# Altium schematic sheet Proyecto_Multicapa_Schematic.SchDoc
size Letter; SheetNumber: 1; SheetTotal: 2
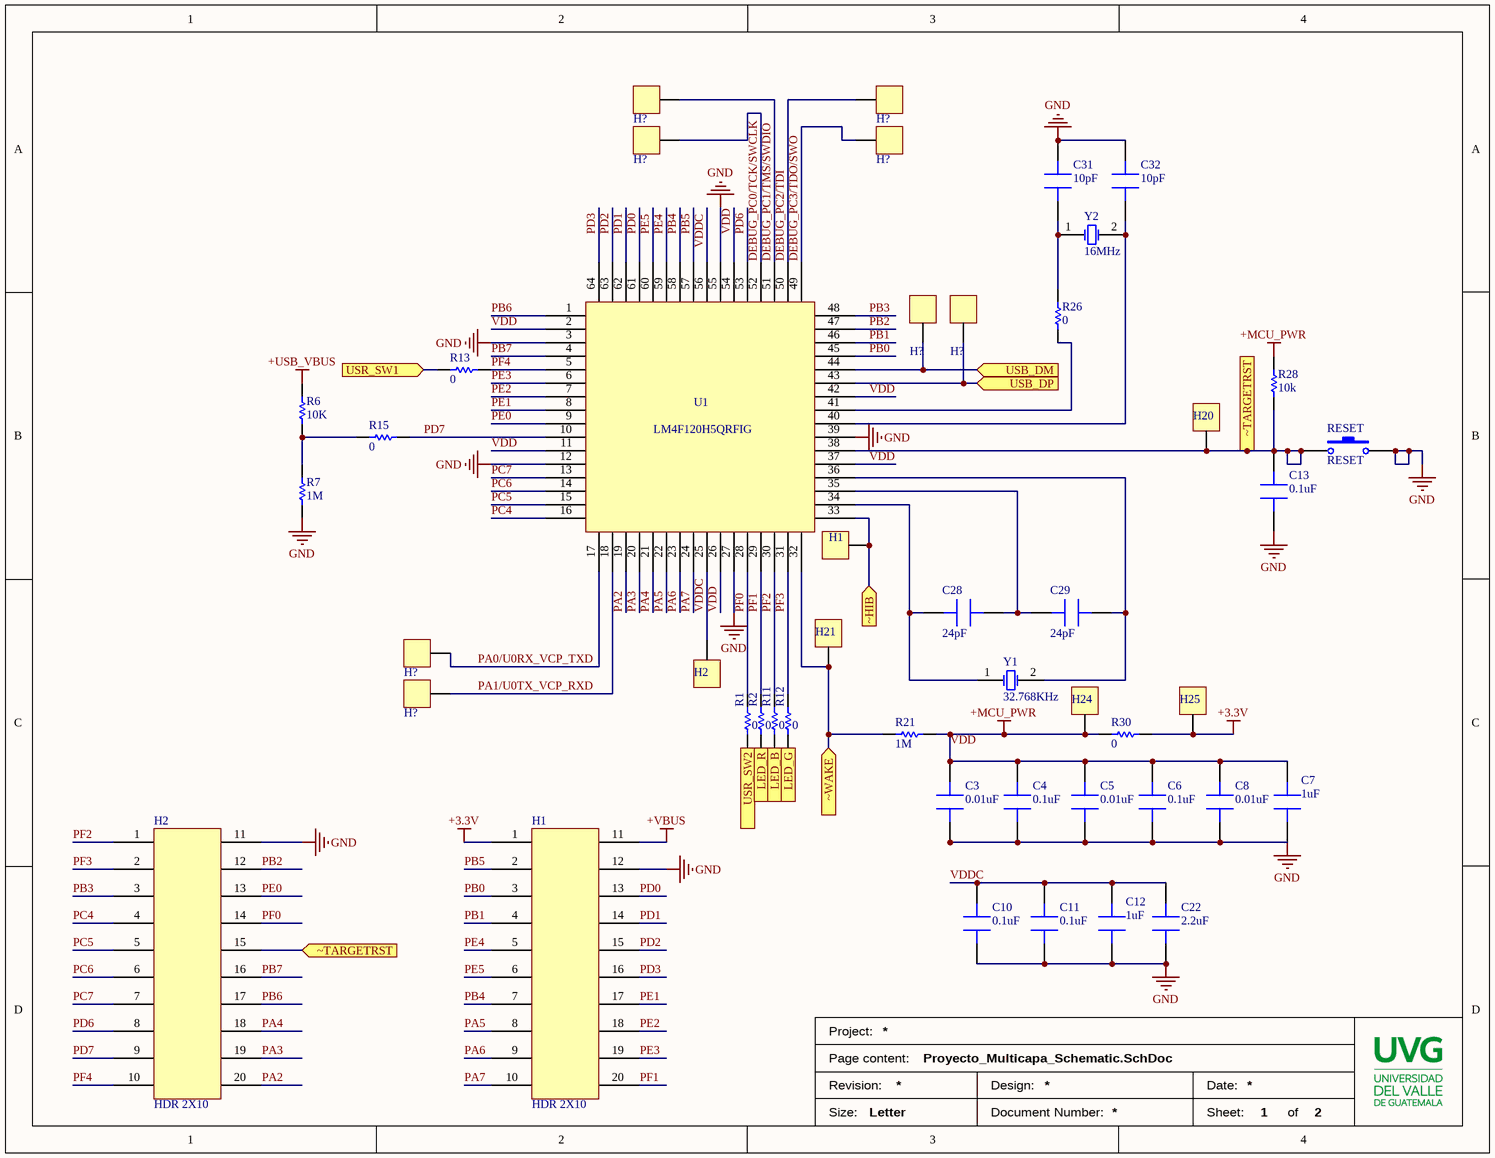
[diagram p0: Proyecto_Multicapa_Schematic.SchDoc]

## Parts
(Parts that share a designator on the sheet are numbered #1, #2 ... from top to bottom, then left to right.)
C3  0.01uF  [C0402]
C4  0.1uF  [C0402]
C5  0.01uF  [C0402]
C6  0.1uF  [C0402]
C7  1uF  [C0402]
C8  0.01uF  [C0402]
C10  0.1uF  [C0402]
C11  0.1uF  [C0402]
C12  1uF  [C0402]
C13  0.1uF  [C0402]
C22  2.2uF  [C0603]
C28  24pF  [C0402]
C29  24pF  [C0402]
C31  10pF  [C0402]
C32  10pF  [C0402]
H1#1  HDR1  [HDR 1X1]  (value not drawn)
H1#2  HDR 2X10  [HDR 2X10]
H2#1  HDR1  [HDR 1X1]  (value not drawn)
H2#2  HDR 2X10  [HDR 2X10]
H20  HDR1  [HDR 1X1]  (value not drawn)
H21  HDR1  [HDR 1X1]  (value not drawn)
H24  HDR1  [HDR 1X1]  (value not drawn)
H25  HDR1  [HDR 1X1]  (value not drawn)
H?#1  HDR1  [HDR 1X1]  (value not drawn)
H?#2  HDR1  [HDR 1X1]  (value not drawn)
H?#3  HDR1  [HDR 1X1]  (value not drawn)
H?#4  HDR1  [HDR 1X1]  (value not drawn)
H?#5  HDR1  [HDR 1X1]  (value not drawn)
H?#6  HDR1  [HDR 1X1]  (value not drawn)
H?#7  HDR1  [HDR 1X1]  (value not drawn)
H?#8  HDR1  [HDR 1X1]  (value not drawn)
R1  0  [Resis 1M]
R2  0  [Resis 1M]
R6  10K  [Resis 1M]
R7  1M  [Resis 1M]
R11  0  [Resis 1M]
R12  0  [Resis 1M]
R13  0  [Resis 1M]
R15  0  [Resis 1M]
R21  1M  [Resis 1M]
R26  0  [Resis 1M]
R28  10k  [Resis 1M]
R30  0  [Resis 1M]
RESET  RESET  [SPST-2]
U1  LM4F120H5QRFIG  [LM4F120H5QRFIG]  (value not drawn)
Y1  32.768KHz  [Crystal 32kHz]
Y2  16MHz  [Crystal 16Mhz]

## Ports
LED_B (in), LED_G (in), LED_R (in), USB_DM (in), USB_DP (in), USR_SW1 (in), USR_SW2 (in), ~HIB (in), ~TARGETRST (in), ~WAKE (in)

## Nets
+3.3V: H1#2.1 H25.1 R30.2
+USB_VBUS: R6.2
+VBUS: H1#2.11
GND: C3.0 C4.0 C5.0 C6.0 C7.0 C8.0 C10.0 C11.0 C12.0 C13.0 C22.0 C31.1 C32.1 H1#2.12 H2#2.11 R7.1 RESET.2 U1.3 U1.12 U1.27 U1.39 U1.55
VDD: C3.1 C4.1 C5.1 C6.1 C7.1 C8.1 H24.1 R21.2 R28.2 R30.1 U1.2 U1.11 U1.26 U1.37 U1.42 U1.54  [also labelled +MCU_PWR]
DEBUG_PC0/TCK/SWCLK: H?#3.1 U1.52
DEBUG_PC1/TMS/SWDIO: H?#1.1 U1.51
DEBUG_PC2/TDI: H?#2.1 U1.50
DEBUG_PC3/TDO/SWO: H?#4.1 U1.49
LED_B: R11.1 ; port LED_B
LED_G: R12.1 ; port LED_G
LED_R: R2.1 ; port LED_R
PA0/U0RX_VCP_TXD: H?#7.1 U1.17
PA1/U0TX_VCP_RXD: H?#8.1 U1.18
PA2: H2#2.20 U1.19
PA3: H2#2.19 U1.20
PA4: H2#2.18 U1.21
PA5: H1#2.8 U1.22
PA6: H1#2.9 U1.23
PA7: H1#2.10 U1.24
PB0: H1#2.3 U1.45
PB1: H1#2.4 U1.46
PB2: H2#2.12 U1.47
PB3: H2#2.3 U1.48
PB4: H1#2.7 U1.58
PB5: H1#2.2 U1.57
PB6: H2#2.17 U1.1
PB7: H2#2.16 U1.4
PC4: H2#2.4 U1.16
PC5: H2#2.5 U1.15
PC6: H2#2.6 U1.14
PC7: H2#2.7 U1.13
PD0: H1#2.13 U1.61
PD1: H1#2.14 U1.62
PD2: H1#2.15 U1.63
PD3: H1#2.16 U1.64
PD6: H2#2.8 U1.53
PD7: H2#2.9 R15.2 U1.10
PE0: H2#2.13 U1.9
PE1: H1#2.17 U1.8
PE2: H1#2.18 U1.7
PE3: H1#2.19 U1.6
PE4: H1#2.5 U1.59
PE5: H1#2.6 U1.60
PF0: H2#2.14 R1.2 U1.28
PF1: H1#2.20 R2.2 U1.29
PF2: H2#2.1 R11.2 U1.30
PF3: H2#2.2 R12.2 U1.31
PF4: H2#2.10 R13.1 U1.5
USB_DM: H?#5.1 U1.44 ; port USB_DM
USB_DP: H?#6.1 U1.43 ; port USB_DP
USR_SW1: R13.2 ; port USR_SW1
USR_SW2: R1.1 ; port USR_SW2
VDDC: C10.1 C11.1 C12.1 C22.1 H2#1.1 U1.25 U1.56
~HIB: H1#1.1 U1.33 ; port ~HIB
~TARGETRST: C13.1 H2#2.15 H20.1 R28.1 RESET.1 U1.38 ; port ~TARGETRST
~WAKE: H21.1 R21.1 U1.32 ; port ~WAKE
NetC28_0: C28.0 U1.34 Y1.1(OSC1)
NetC28_1: C28.1 C29.0 U1.35
NetC29_1: C29.1 U1.36 Y1.2(OSC2)
NetC31_0: C31.0 R26.2 Y2.1(OSC1)
NetC32_0: C32.0 U1.40 Y2.2(OSC2)
NetR6_1: R6.1 R7.2 R15.1
NetR26_1: R26.1 U1.41

## Notes on the sheet
- Project:
- Page content:
- Revision:
- Size:
- Letter
- Design:
- Document Number:
- Date:
- Sheet:
- of

## Library data of the parts
C3 C5 C8 = TMK105B7103KV-F: 0402 0.01 uF 25 V ±10% X7R Automotive Multilayer Ceramic Capacitor; Manufacturer: Taiyo Yuden; Capacitance: 10nF; Voltage Rating: 25V; Supplier 1: Newark; Manufacturer Part Number: TMK105B7103KV-F; Stock 1: 2; Pricing 1: 1 = 0.00200, 25 = 0.00200, 100 = 0.00200, 250 = 0.00200, 500 = 0.00200, 1000 = 0.00200, 2500 = 0.00200, 5000 = 0.00200 (USD); RoHS: Yes; Mount: Surface Mount; Case/Package: 0402; Case Code (Metric): 1005; Case Code (Imperial): 0402; Contact Plating: Tin; Min Operating Temperature: -55°C; Max Operating Temperature: 125°C; Tolerance: 10%; Package Quantity: 1; Packaging: Tape and Reel; Voltage Rating (DC): 25V; Dielectric: X7R; Termination: SMD/SMT; Resistor Type: Ceramic; Series: M; Construction: Flat; Voltage: 25V; Length: 1mm; Width: 0.02inch; Height: 0.5mm; Thickness: 0.022inch; Depth: 0.5mm; REACH SVHC: Unknown; Halogen Free: Halogen Free; RoHS Compliant: Yes; ComponentLink1URL: https://datasheet.ciiva.com/129/tmk105b7103kv-f-ss-129699.pdf?src-supplier=Digi-Key; ComponentLink1Description: https://datasheet.ciiva.com/129/tmk105b7103kv-f-ss-129699.pdf?src-supplier=Digi-Key; ComponentLink2URL: https://datasheet.ciiva.com/30192/438tmk105b7103kv-f-30192315.pdf?src-supplier=Onlinecomponents.com; ComponentLink2Description: https://datasheet.ciiva.com/30192/438tmk105b7103kv-f-30192315.pdf?src-supplier=Onlinecomponents.com; ComponentLink3URL: https://datasheet.ciiva.com/15922/204tmk105b7103kv-f-15922348.pdf?src-supplier=Onlinecomponents.com; ComponentLink3Description: https://datasheet.ciiva.com/15922/204tmk105b7103kv-f-15922348.pdf?src-supplier=Onlinecomponents.com; ComponentLink4URL: https://datasheet.ciiva.com/30156/190tmk105b7103kv-f-30156174.pdf?src-supplier=Onlinecomponents.com; ComponentLink4Description: https://datasheet.ciiva.com/30156/190tmk105b7103kv-f-30156174.pdf?src-supplier=Onlinecomponents.com; ComponentLink5URL: https://datasheet.ciiva.com/28645/746258-28645254.pdf?src-supplier=Element14; ComponentLink5Description: https://datasheet.ciiva.com/28645/746258-28645254.pdf?src-supplier=Element14; ComponentLink6URL: https://datasheet.ciiva.com/7975/746258-7975835.pdf?src-supplier=Element14; ComponentLink6Description: https://datasheet.ciiva.com/7975/746258-7975835.pdf?src-supplier=Element14; Supplier Part Number 1: 77M8496
C4 C6 C10 C11 C13 = EMK105B7104KV-F: 0402 0.1 uF 16 V ±10% Tolerance X7R Multilayer Ceramic Chip Capacitor; Manufacturer: Taiyo Yuden; Capacitance: 100nF; Voltage Rating (DC): 16V; Supplier 1: RSComponents; Manufacturer Part Number: EMK105B7104KV-F; Stock 1: 30000; Pricing 1: 10000 = 0.00300 (GBP); RoHS: Yes; Mount: Surface Mount; Case/Package: 0402; Number of Pins: 2; Case Code (Metric): 1005; Case Code (Imperial): 0402; Min Operating Temperature: -55°C; Max Operating Temperature: 125°C; Tolerance: 10%; Packaging: Tape and Reel; Dielectric: X7R; Package Quantity: 1; Voltage Rating: 16V; Termination: SMD/SMT; Series: M; Construction: Flat; Resistor Type: Ceramic; Length: 1mm; Width: 0.02inch; Height: 0.5mm; Thickness: 0.022inch; Depth: 0.5mm; Radiation Hardening: No; Halogen Free: Halogen Free; REACH SVHC: Unknown; RoHS Compliant: Yes; Lead Free: Lead Free; ComponentLink1URL: https://datasheet.ciiva.com/129/emk105b7104kv-f-ss-129714.pdf?src-supplier=Digi-Key; ComponentLink1Description: https://datasheet.ciiva.com/129/emk105b7104kv-f-ss-129714.pdf?src-supplier=Digi-Key; ComponentLink2URL: https://datasheet.ciiva.com/30227/emk105b7104kv-f-30227394.pdf?src-supplier=Onlinecomponents.com; ComponentLink2Description: https://datasheet.ciiva.com/30227/emk105b7104kv-f-30227394.pdf?src-supplier=Onlinecomponents.com; ComponentLink3URL: https://datasheet.ciiva.com/22748/746258-22748959.pdf?src-supplier=Element14; ComponentLink3Description: https://datasheet.ciiva.com/22748/746258-22748959.pdf?src-supplier=Element14; Supplier Part Number 1: 1721352
C7 C12 = 100R07X105KV4T: Multilayer Ceramic Capacitor, Tanceram Series, 1 - F, - 10%, X5R, 10 V, 0402 [1005 Metric]; Manufacturer: Johanson; Voltage Rating: 10V; Supplier 1: Mouser; Manufacturer Part Number: 100R07X105KV4T; Stock 1: 61365; Pricing 1: 1 = 0.28000, 10 = 0.19300, 50 = 0.19300, 100 = 0.09800, 500 = 0.06700, 1000 = 0.06000, 2500 = 0.05700, 5000 = 0.05200, 10000 = 0.04800 (USD); RoHS: Yes; Mount: Surface Mount; Case/Package: 0402; Number of Pins: 2; Case Code (Metric): 1005; Case Code (Imperial): 0402; Weight: 2.3E-05oz; Min Operating Temperature: -55°C; Max Operating Temperature: 85°C; Capacitance: 1uF; Tolerance: 10%; Packaging: Tape and Reel; Package Quantity: 10000; Voltage Rating (DC): 10V; Dielectric: X5R; Termination: SMD/SMT; Series: TANCERAM®; Length: 1.02mm; Width: 0.02inch; Height: 0.64mm; Thickness: 0.025inch; Depth: 0.51mm; Radiation Hardening: No; REACH SVHC: No SVHC; RoHS Compliant: Yes; ComponentLink1URL: https://datasheet.ciiva.com/26948/getdatasheetpartid-789067-26948543.pdf?src-supplier=Verical; ComponentLink1Description: https://datasheet.ciiva.com/26948/getdatasheetpartid-789067-26948543.pdf?src-supplier=Verical; ComponentLink2URL: https://datasheet.ciiva.com/22693/jdi-full-catalog-2012-01-22693744.pdf?src-supplier=Element14; ComponentLink2Description: https://datasheet.ciiva.com/22693/jdi-full-catalog-2012-01-22693744.pdf?src-supplier=Element14; Supplier Part Number 1: 605-100R07X105KV4T
C22 = GRM188R61C225KE15D: 0603 2.2 uF 16 V ±10% Tolerance X5R SMT Multilayer Ceramic Capacitor; Manufacturer: Murata; Voltage Rating: 16V; Supplier 1: Arrow Electronics; Manufacturer Part Number: GRM188R61C225KE15D; Stock 1: 80000; Pricing 1: 4000 = 0.07480, 8000 = 0.06840, 12000 = 0.05830, 20000 = 0.05480, 24000 = 0.05360, 100000 = 0.05210 (USD); RoHS: Yes; Mount: Surface Mount; Case/Package: 0603; Case Code (Imperial): 0603; Case Code (Metric): 1608; Material: Ceramic; Min Operating Temperature: -55°C; Max Operating Temperature: 85°C; Capacitance: 2.2uF; Tolerance: 10%; Dielectric: X5R; Voltage Rating (DC): 16V; Packaging: Tape and Reel; Package Quantity: 1; Termination: SMD/SMT; Voltage: 16V; Length: 1.6mm; Width: 0.8mm; Height: 0.8mm; Thickness: 0.035inch; Depth: 0.8mm; Radiation Hardening: No; RoHS Compliant: Yes; Lead Free: Lead Free; REACH SVHC: No SVHC; ComponentLink1URL: https://datasheet.ciiva.com/135/grm188r61c225ke15-01-135062.pdf?src-supplier=Digi-Key; ComponentLink1Description: https://datasheet.ciiva.com/135/grm188r61c225ke15-01-135062.pdf?src-supplier=Digi-Key; ComponentLink2URL: https://datasheet.ciiva.com/135/grm188r61c225ke15-01-135063.pdf?src-supplier=Digi-Key; ComponentLink2Description: https://datasheet.ciiva.com/135/grm188r61c225ke15-01-135063.pdf?src-supplier=Digi-Key; ComponentLink3URL: https://datasheet.ciiva.com/5417/product-5417088.pdf?src-supplier=Mouser; ComponentLink3Description: https://datasheet.ciiva.com/5417/product-5417088.pdf?src-supplier=Mouser; ComponentLink4URL: https://datasheet.ciiva.com/3777/147grm188r61c225ke1523-3777042.pdf?src-supplier=Arrow+Electronics; ComponentLink4Description: https://datasheet.ciiva.com/3777/147grm188r61c225ke1523-3777042.pdf?src-supplier=Arrow+Electronics; ComponentLink5URL: https://datasheet.ciiva.com/29199/454457-da-01-en-vs-kondensator-0603-29199689.pdf?src-supplier=Conrad; ComponentLink5Description: https://datasheet.ciiva.com/29199/454457-da-01-en-vs-kondensator-0603-29199689.pdf?src-supplier=Conrad; ComponentLink6URL: https://datasheet.ciiva.com/135/grm188r61c225ke15-01-135061.pdf?src-supplier=Digi-Key; ComponentLink6Description: https://datasheet.ciiva.com/135/grm188r61c225ke15-01-135061.pdf?src-supplier=Digi-Key; ComponentLink7URL: https://datasheet.ciiva.com/16369/product-16369274.pdf?src-supplier=Future+Electronics; ComponentLink7Description: https://datasheet.ciiva.com/16369/product-16369274.pdf?src-supplier=Future+Electronics; Supplier Part Number 1: GRM188R61C225KE15D
C28 C29 = C1005C0G1H240J: Capacitor Ceramic 24PF 50V, C0G, 5%, 0402, Full Reel; Manufacturer: TDK; Supplier 1: Newark; Manufacturer Part Number: C1005C0G1H240J; Stock 1: 0; RoHS: Yes; Mount: Surface Mount; Case/Package: 0402; Number of Pins: 2; Case Code (Metric): 1005; Case Code (Imperial): 0402; Dielectric Material: Ceramic; Min Operating Temperature: -55°C; Max Operating Temperature: 125°C; Package Quantity: 1; Capacitance: 24pF; Voltage Rating: 50V; Tolerance: 5%; Packaging: Tape and Reel; Voltage Rating (DC): 50V; Dielectric: C0G; Termination: SMD/SMT; Resistor Type: Ceramic; Series: C; Construction: Flat; Length: 0.039inch; Width: 0.02inch; Height: 0.5mm; Thickness: 0.022inch; ComponentLink1URL: https://datasheet.ciiva.com/161/c-series-generalappl-b11-161778.pdf?src-supplier=Digi-Key; ComponentLink1Description: https://datasheet.ciiva.com/161/c-series-generalappl-b11-161778.pdf?src-supplier=Digi-Key; ComponentLink2URL: https://datasheet.ciiva.com/161/c-series-generalappl-b11-161779.pdf?src-supplier=Digi-Key; ComponentLink2Description: https://datasheet.ciiva.com/161/c-series-generalappl-b11-161779.pdf?src-supplier=Digi-Key; ComponentLink3URL: https://datasheet.ciiva.com/161/c-series-generalappl-b11-161780.pdf?src-supplier=Digi-Key; ComponentLink3Description: https://datasheet.ciiva.com/161/c-series-generalappl-b11-161780.pdf?src-supplier=Digi-Key; ComponentLink4URL: https://datasheet.ciiva.com/5418/mlcc-commercial-general-en-5418382.pdf?src-supplier=Mouser; ComponentLink4Description: https://datasheet.ciiva.com/5418/mlcc-commercial-general-en-5418382.pdf?src-supplier=Mouser; Supplier Part Number 1: 87R3204
C31 C32 = GRM1555C1H100JZ01D: Cap Ceramic 10pF 50V C0G 5% SMD 0402 125°C Paper T/R; Manufacturer: Murata; Insulation Resistance: 10GR; Temperature Coefficient: 30ppm/°C; Supplier 1: Farnell; Manufacturer Part Number: GRM1555C1H100JZ01D; Stock 1: 0; Pricing 1: 1 = 37.68000, 3 = 28.53000 (GBP); RoHS: Yes; Mount: Surface Mount; Case/Package: 0402; Number of Pins: 2; Case Code (Imperial): 0402; Case Code (Metric): 1005; Dielectric Material: Ceramic; Min Operating Temperature: -55°C; Max Operating Temperature: 125°C; Capacitance: 10pF; Tolerance: 5%; Dielectric: C0G; Voltage Rating: 50V; Voltage Rating (DC): 50V; Packaging: Tape and Reel; Package Quantity: 1; Termination: SMD/SMT; Voltage: 50V; Series: GRM; Construction: Flat; Length: 1mm; Width: 0.5mm; Height: 0.5mm; Thickness: 0.022inch; Depth: 0.5mm; Size: 0.5mm; Radiation Hardening: No; REACH SVHC: No SVHC; Lead Free: Lead Free; RoHS Compliant: Yes; ComponentLink1URL: https://datasheet.ciiva.com/129/partnumbering-e-01-129819.pdf?src-supplier=Digi-Key; ComponentLink1Description: https://datasheet.ciiva.com/129/partnumbering-e-01-129819.pdf?src-supplier=Digi-Key; ComponentLink2URL: https://datasheet.ciiva.com/129/partnumbering-e-01-129820.pdf?src-supplier=Digi-Key; ComponentLink2Description: https://datasheet.ciiva.com/129/partnumbering-e-01-129820.pdf?src-supplier=Digi-Key; ComponentLink3URL: https://datasheet.ciiva.com/129/partnumbering-e-01-129821.pdf?src-supplier=Digi-Key; ComponentLink3Description: https://datasheet.ciiva.com/129/partnumbering-e-01-129821.pdf?src-supplier=Digi-Key; ComponentLink4URL: https://datasheet.ciiva.com/19476/1855887-19476237.pdf?src-supplier=Jameco; ComponentLink4Description: https://datasheet.ciiva.com/19476/1855887-19476237.pdf?src-supplier=Jameco; ComponentLink5URL: https://datasheet.ciiva.com/18184/getdatasheetpartid-91958-18184166.pdf?src-supplier=Verical; ComponentLink5Description: https://datasheet.ciiva.com/18184/getdatasheetpartid-91958-18184166.pdf?src-supplier=Verical; ComponentLink6URL: https://datasheet.ciiva.com/11787/0900766b807a1cab-11787097.pdf?src-supplier=RSComponents; ComponentLink6Description: https://datasheet.ciiva.com/11787/0900766b807a1cab-11787097.pdf?src-supplier=RSComponents; ComponentLink7URL: https://datasheet.ciiva.com/6068/1747431-6068159.pdf?src-supplier=Farnell; ComponentLink7Description: https://datasheet.ciiva.com/6068/1747431-6068159.pdf?src-supplier=Farnell; ComponentLink8URL: https://datasheet.ciiva.com/11607/c02e-11607480.pdf?src-supplier=Avnet; ComponentLink8Description: https://datasheet.ciiva.com/11607/c02e-11607480.pdf?src-supplier=Avnet; ComponentLink9URL: https://datasheet.ciiva.com/14116/grmseries-tc-hitype-eng-14116856.pdf?src-supplier=Distrelec; ComponentLink9Description: https://datasheet.ciiva.com/14116/grmseries-tc-hitype-eng-14116856.pdf?src-supplier=Distrelec; ComponentLink10URL: https://datasheet.ciiva.com/14116/grmseries-tc-hitype-eng-14116917.pdf?src-supplier=Distrelec; ComponentLink10Description: https://datasheet.ciiva.com/14116/grmseries-tc-hitype-eng-14116917.pdf?src-supplier=Distrelec; ComponentLink11URL: https://datasheet.ciiva.com/7828/1747431-7828813.pdf?src-supplier=Element14; ComponentLink11Description: https://datasheet.ciiva.com/7828/1747431-7828813.pdf?src-supplier=Element14; ComponentLink12URL: https://datasheet.ciiva.com/7828/1747431-7828815.pdf?src-supplier=Element14; ComponentLink12Description: https://datasheet.ciiva.com/7828/1747431-7828815.pdf?src-supplier=Element14; Supplier Part Number 1: 1118131
H1#1 H2#1 H20 H21 H24 H25 H?#1-H?#8 = Header 1x1: Header 1x1, hole
H1#2 H2#2 = SSW-110-23-S-D: Tiger Buy Socket Strip With Pcb Tails, 0.100" Pitch Rohs Compliant: Yes; Manufacturer: Samtec; Number of Contacts: 20; Gender: Female; Pitch: 2.54mm; Supplier 1: RSComponents; Manufacturer Part Number: SSW-110-23-S-D; Stock 1: 63; Pricing 1: 1 = 2.69000, 10 = 2.46000, 50 = 2.32000, 100 = 2.19000, 250 = 1.97000 (GBP); RoHS: Yes; Mount: Through Hole; Contact Plating: Gold; Number of Rows: 2; Packaging: Bulk; Termination: Solder; Radiation Hardening: No; RoHS Compliant: Yes; ComponentLink1URL: ftp://ftp.samtec.com/webfiles/PDF/SSQ_TH.PDF?src-supplier=Avnet; ComponentLink1Description: ftp://ftp.samtec.com/webfiles/PDF/SSQ_TH.PDF?src-supplier=Avnet; Supplier Part Number 1: 2079196
R1 R2 R6 R7 R11-R13 R15 R21 R26 R28 R30 = MCR01MRTF1004: Res Thick Film 0402 1M Ohm 1% 0.063W(1/16W) ±100ppm/C Pad SMD T/R; Manufacturer: Rohm; Resistance: 1MR; Max Power Dissipation: 63mW; Temperature Coefficient: 100ppm/°C; Voltage Rating (DC): 50V; Supplier 1: Digi-Key; Manufacturer Part Number: MCR01MRTF1004; Stock 1: 0; RoHS: Yes; Case/Package: 0402; Case Code (Metric): 1005; Case Code (Imperial): 0402; Min Operating Temperature: -55°C; Max Operating Temperature: 155°C; Package Quantity: 1; Tolerance: 1%; Packaging: Tape and Reel; Resistor Type: Thick Film; Number of Terminations: 2; Series: MCR; Length: 0.039inch; Width: 0.02inch; Height: 0.016inch; Lead Free: Lead Free; RoHS Compliant: Yes; ComponentLink1URL: https://datasheet.ciiva.com/2519/mcr01mrt-seriesspec-2519945.pdf?src-supplier=Digi-Key; ComponentLink1Description: https://datasheet.ciiva.com/2519/mcr01mrt-seriesspec-2519945.pdf?src-supplier=Digi-Key; ComponentLink2URL: https://datasheet.ciiva.com/2519/mcr01mrt-seriesspec-2519946.pdf?src-supplier=Digi-Key; ComponentLink2Description: https://datasheet.ciiva.com/2519/mcr01mrt-seriesspec-2519946.pdf?src-supplier=Digi-Key; ComponentLink3URL: https://datasheet.ciiva.com/2519/mcr01mrt-seriesspec-2519947.pdf?src-supplier=Digi-Key; ComponentLink3Description: https://datasheet.ciiva.com/2519/mcr01mrt-seriesspec-2519947.pdf?src-supplier=Digi-Key; Supplier Part Number 1: RHM1.00MCDCT-ND
RESET = SW-PB: Switch; Published: 24-Mar-1999; LatestRevisionDate: 17-Jul-2002; LatestRevisionNote: Re-released for DXP Platform.; PackageReference: SPST-2; Publisher: Altium Limited; PackageDescription: Switch; 2 Leads
U1 = LM4F120H5QRFIG: MCU 32-bit Stellaris ARM Cortex M4F RISC 256KB Flash 1.2V/3.3V 64-Pin LQFP Tray; Manufacturer: Texas Instruments; RAM Size: 32KB; Max Power Dissipation: 560mW; Interface: I2C,USB,CAN,UART; Number of Timers/Counters: 13; Data Bus Width: 32b; Number of Programmable I/O: 43; Watchdog Timer: Yes; Max Frequency: 80MHz; Supplier 1: Arrow Electronics; Manufacturer Part Number: LM4F120H5QRFIG; Stock 1: 0; RoHS: Yes; Case/Package: LQFP; Min Operating Temperature: -40°C; Max Operating Temperature: 85°C; Packaging: Tray; Memory Type: FLASH; Memory Size: 256KB; Core Architecture: ARM; Radiation Hardening: No; RoHS Compliant: Yes; ComponentLink1URL: http://www.ti.com/lit/ds/symlink/lm4f120h5qr.pdf?src-supplier=Avnet; ComponentLink1Description: http://www.ti.com/lit/ds/symlink/lm4f120h5qr.pdf?src-supplier=Avnet; Supplier Part Number 1: LM4F120H5QRFIG
Y1 = AB26TRB-32.768KHZ-T: Crystal, Cylindrical 32.768Khz, 12.5F, 20Ppm, 2 X 6 Formed Lead Smd Rohs Compliant: Yes; Manufacturer: Abracon; Load Capacitance: 12.5pF; Series Resistance: 50kR; Frequency Stability: -0.034ppm; Supplier 1: Digi-Key; Manufacturer Part Number: AB26TRB-32.768KHZ-T; Stock 1: 66665; Pricing 1: 1 = 0.65000, 10 = 0.57400, 50 = 0.53660, 100 = 0.47420, 500 = 0.44928, 1000 = 0.37440 (USD); RoHS: Yes; Mount: Surface Mount; Case/Package: Radial; Number of Pins: 2; Min Operating Temperature: -40°C; Max Operating Temperature: 85°C; Frequency: 32.768kHz; Frequency Tolerance: 20ppm; Packaging: Tape and Reel; ESR (Equivalent Series Resistance): 50kR; Package Quantity: 500; Tolerance: 20ppm; Termination: Radial; Series: AB26TRB; Operating Frequency: 32.768 kHz; Length: 6mm; Height: 0.075inch; Lead Pitch: 2.54mm; Depth: 1.9mm; REACH SVHC: No SVHC; Lead Free: Lead Free; ComponentLink1URL: https://datasheet.ciiva.com/4945/ab26tr-30941-4945140.pdf?src-supplier=Mouser; ComponentLink1Description: https://datasheet.ciiva.com/4945/ab26tr-30941-4945140.pdf?src-supplier=Mouser; ComponentLink2URL: https://datasheet.ciiva.com/1357/ab26tr-1357201.pdf?src-supplier=Element14; ComponentLink2Description: https://datasheet.ciiva.com/1357/ab26tr-1357201.pdf?src-supplier=Element14; ComponentLink3URL: https://datasheet.ciiva.com/854/ab26trb-854381.pdf?src-supplier=Digi-Key; ComponentLink3Description: https://datasheet.ciiva.com/854/ab26trb-854381.pdf?src-supplier=Digi-Key; ComponentLink4URL: https://datasheet.ciiva.com/854/ab26trb-854382.pdf?src-supplier=Digi-Key; ComponentLink4Description: https://datasheet.ciiva.com/854/ab26trb-854382.pdf?src-supplier=Digi-Key; ComponentLink5URL: https://datasheet.ciiva.com/854/ab26trb-854383.pdf?src-supplier=Digi-Key; ComponentLink5Description: https://datasheet.ciiva.com/854/ab26trb-854383.pdf?src-supplier=Digi-Key; ComponentLink6URL: https://datasheet.ciiva.com/3174/ab26trb-3174233.pdf?src-supplier=Avnet; ComponentLink6Description: https://datasheet.ciiva.com/3174/ab26trb-3174233.pdf?src-supplier=Avnet; ComponentLink7URL: https://datasheet.ciiva.com/16215/ab26trb-16215317.pdf?src-supplier=Future+Electronics; ComponentLink7Description: https://datasheet.ciiva.com/16215/ab26trb-16215317.pdf?src-supplier=Future+Electronics; ComponentLink8URL: https://datasheet.ciiva.com/28508/270658-28508373.pdf?src-supplier=Element14; ComponentLink8Description: https://datasheet.ciiva.com/28508/270658-28508373.pdf?src-supplier=Element14; Supplier Part Number 1: 535-9033-1-ND
Y2 = ABM3-16.000MHZ-B2-T: Crystal 16MHz ±20ppm (Tol) ±50ppm (Stability) 18pF FUND 40Ohm 2-Pin Mini-CSMD T/R; Manufacturer: Abracon; ESR (Equivalent Series Resistance): 40R; Series Resistance: 60R; Supplier 1: Digi-Key; Manufacturer Part Number: ABM3-16.000MHZ-B2-T; Stock 1: 0; Pricing 1: 1 = 0.95000, 10 = 0.83900, 50 = 0.78440, 100 = 0.69310, 500 = 0.65664 (USD); RoHS: Yes; Mount: Surface Mount; Case/Package: CSMD; Number of Pins: 2; Min Operating Temperature: -20°C; Max Operating Temperature: 70°C; Frequency: 16MHz; Load Capacitance: 18pF; Packaging: Tape and Reel; Frequency Tolerance: 20ppm; Package Quantity: 1000; Tolerance: 20ppm; Frequency Stability: 50ppm; Termination: SMD/SMT; Resistor Type: Ceramic; Accuracy: 20ppm; Series: ABM3; Operating Frequency: 16 MHz; Length: 5mm; Width: 3.2mm; Height: 0.051inch; Depth: 3.2mm; REACH SVHC: Yes; Lead Free: Lead Free; ComponentLink1URL: https://datasheet.ciiva.com/15116/getdatasheetpartid-719852-15116752.pdf?src-supplier=Verical; ComponentLink1Description: https://datasheet.ciiva.com/15116/getdatasheetpartid-719852-15116752.pdf?src-supplier=Verical; ComponentLink2URL: https://datasheet.ciiva.com/855/abm3-855737.pdf?src-supplier=Digi-Key; ComponentLink2Description: https://datasheet.ciiva.com/855/abm3-855737.pdf?src-supplier=Digi-Key; ComponentLink3URL: https://datasheet.ciiva.com/855/abm3-855738.pdf?src-supplier=Digi-Key; ComponentLink3Description: https://datasheet.ciiva.com/855/abm3-855738.pdf?src-supplier=Digi-Key; ComponentLink4URL: https://datasheet.ciiva.com/855/abm3-855739.pdf?src-supplier=Digi-Key; ComponentLink4Description: https://datasheet.ciiva.com/855/abm3-855739.pdf?src-supplier=Digi-Key; ComponentLink5URL: https://datasheet.ciiva.com/4945/abm3-47699-4945240.pdf?src-supplier=Mouser; ComponentLink5Description: https://datasheet.ciiva.com/4945/abm3-47699-4945240.pdf?src-supplier=Mouser; ComponentLink6URL: https://datasheet.ciiva.com/16209/abm3-16209965.pdf?src-supplier=Future+Electronics; ComponentLink6Description: https://datasheet.ciiva.com/16209/abm3-16209965.pdf?src-supplier=Future+Electronics; Supplier Part Number 1: 535-9103-6-ND